# EAGLE design mmcserial (EAGLE 4.01)
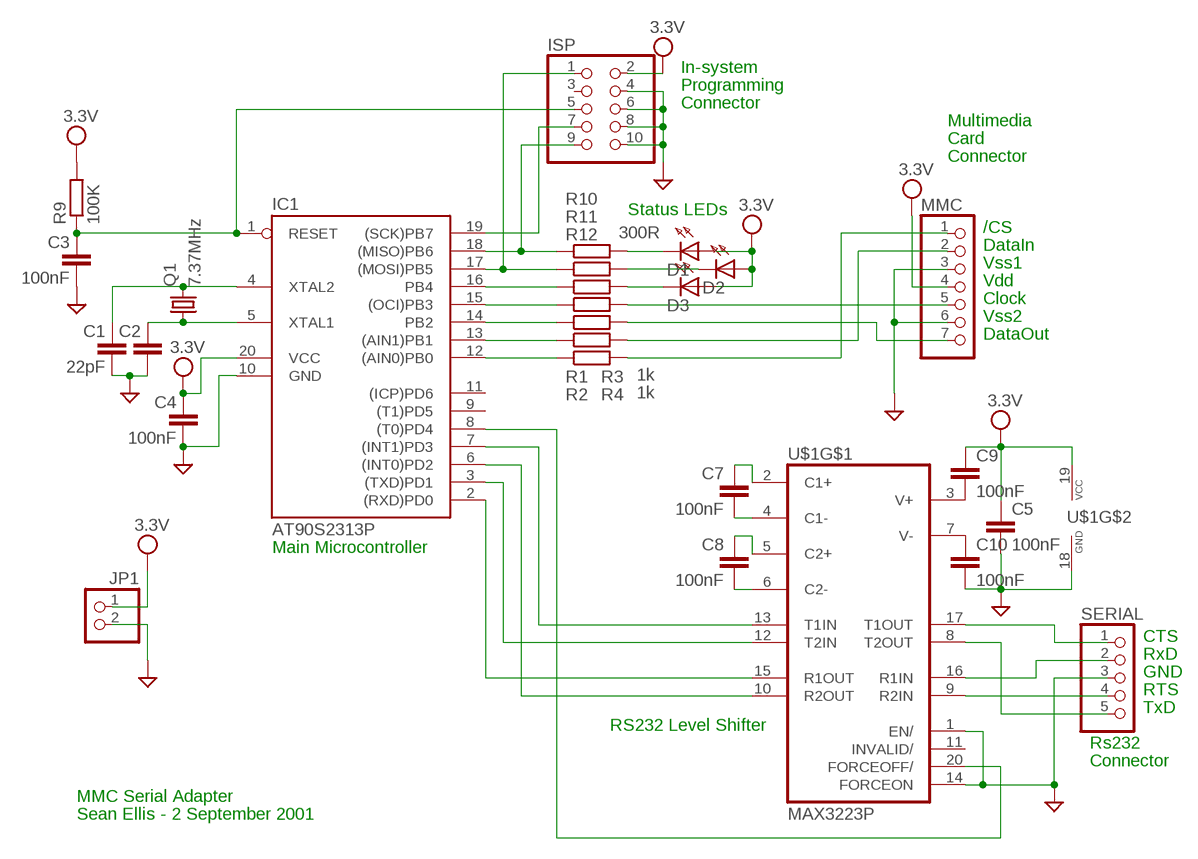
[diagram p0: schematic, sheet 1]

## Parts
C1  22pF  C-EU025-024X044  [C025-024X044]
C2  C-EU025-024X044  [C025-024X044]
C3  100nF  C-EU050-024X044  [C050-024X044]
C4  100nF  C-EU050-024X044  [C050-024X044]
C5  100nF  C-EU050-024X044  [C050-024X044]
C7  100nF  C-EU050-024X044  [C050-024X044]
C8  100nF  C-EU050-024X044  [C050-024X044]
C9  100nF  C-EU050-024X044  [C050-024X044]
C10  100nF  C-EU050-024X044  [C050-024X044]
D1  LED2X5  [LED2X5]
D2  LED2X5  [LED2X5]
D3  LED2X5  [LED2X5]
IC1  AT90S2313P  [DIL20]
ISP  PINHD-2X5  [2X05]
JP1  PINHD-1X2  [1X02]
MMC  PINHD-1X7  [1X07]
Q1  7.37MHz  HC49/S  [HC49/S]
R1  1k  R-EU_0204/5  [0204/5]
R2  R-EU_0204/V2  [0204V]
R3  R-EU_0204/5  [0204/5]
R4  1k  R-EU_0204/5  [0204/5]
R9  100K  R-EU_0204/7  [0204/7]
R10  R-EU_0204/V2  [0204V]
R11  R-EU_0204/5  [0204/5]
R12  300R  R-EU_0204/7  [0204/7]
SERIAL  PINHD-1X5  [1X05]
U$1  MAX3223P  [DIL20]

## Nets
GND: C1.1 C2.1 C3.1 C4.1 C5.1 C10.1 IC1.10(GND) ISP.4 ISP.6 ISP.8 ISP.10 JP1.2 MMC.3 MMC.6 SERIAL.3 U$1.1(EN/) U$1.14(FORCEON) U$1.18(GND)
N$1: SERIAL.1 U$1.17(T1OUT)
N$2: SERIAL.5 U$1.8(T2OUT)
N$3: C3.2 IC1.1(RESET) ISP.5 R9.1
N$5: SERIAL.2 U$1.16(R1IN)
N$6: IC1.8((T0)PD4) U$1.20(FORCEOFF/)
N$7: C9.1 U$1.3(V+)
N$8: IC1.2((RXD)PD0) U$1.15(R1OUT)
N$9: IC1.3((TXD)PD1) U$1.12(T2IN)
N$10: IC1.17((MOSI)PB5) ISP.1 R11.1
N$11: IC1.15((OCI)PB3) R2.1
N$12: IC1.14(PB2) R1.1
N$14: IC1.16(PB4) R12.1
N$15: C10.2 U$1.7(V-)
N$16: MMC.5 R2.2
N$17: SERIAL.4 U$1.9(R2IN)
N$18: IC1.6((INT0)PD2) U$1.10(R2OUT)
N$19: IC1.7((INT1)PD3) U$1.13(T1IN)
N$20: C2.2 IC1.5(XTAL1) Q1.1
N$21: C1.2 IC1.4(XTAL2) Q1.2
N$22: IC1.12((AIN0)PB0) R4.1
N$23: IC1.13((AIN1)PB1) R3.1
N$24: IC1.18((MISO)PB6) ISP.9 R10.1
N$25: IC1.19((SCK)PB7) ISP.7
N$26: C7.2 U$1.2(C1+)
N$27: C7.1 U$1.4(C1-)
N$28: C8.2 U$1.5(C2+)
N$29: C8.1 U$1.6(C2-)
N$30: MMC.7 R1.2
N$31: MMC.2 R3.2
N$32: MMC.1 R4.2
N$33: D1.K(C) R10.2
N$34: D3.K(C) R12.2
N$35: D2.K(C) R11.2
VDD: C4.2 C5.2 C9.2 D1.A D2.A D3.A IC1.20(VCC) ISP.2 JP1.1 MMC.4 R9.2 U$1.19(VCC) ; supply symbol labelled 3.3V
Unconnected: IC1.9((T1)PD5) IC1.11((ICP)PD6) ISP.3 U$1.11(INVALID/)

## Notes on the sheet
- In-system
- Programming
- Connector
- Multimedia
- Card
- Connector
- Status LEDs
- /CS
- DataIn
- Vss1
- Vdd
- Clock
- Vss2
- DataOut
- Main Microcontroller
- CTS
- RxD
- GND
- RTS
- TxD
- RS232 Level Shifter
- Rs232
- Connector
- MMC Serial Adapter
- Sean Ellis - 2 September 2001

## Library data of the parts
C1-C5 C7-C10 = rcl:C-EU: CAPACITOR, European symbol
D1-D3 = led:LED2X5: LED 2 x 5 mm, rectangle
IC1 = atmel:AT90S2313: MICROCONTROLLER 2 Kbytes FLASH 128 bytes SRAM 128 bytes EEPROM UART
ISP = pinhead:PINHD-2X5: PIN HEADER
JP1 = pinhead:PINHD-1X2: PIN HEADER
MMC = pinhead:PINHD-1X7: PIN HEADER
Q1 = crystal:HC49/S: CRYSTAL
R1-R4 R9-R12 = rcl:R-EU_: RESISTOR, European symbol
SERIAL = pinhead:PINHD-1X5: PIN HEADER
U$1 = maxim:MAX3223: MAX3223 RS232 Level Converter 3.3V

## Board
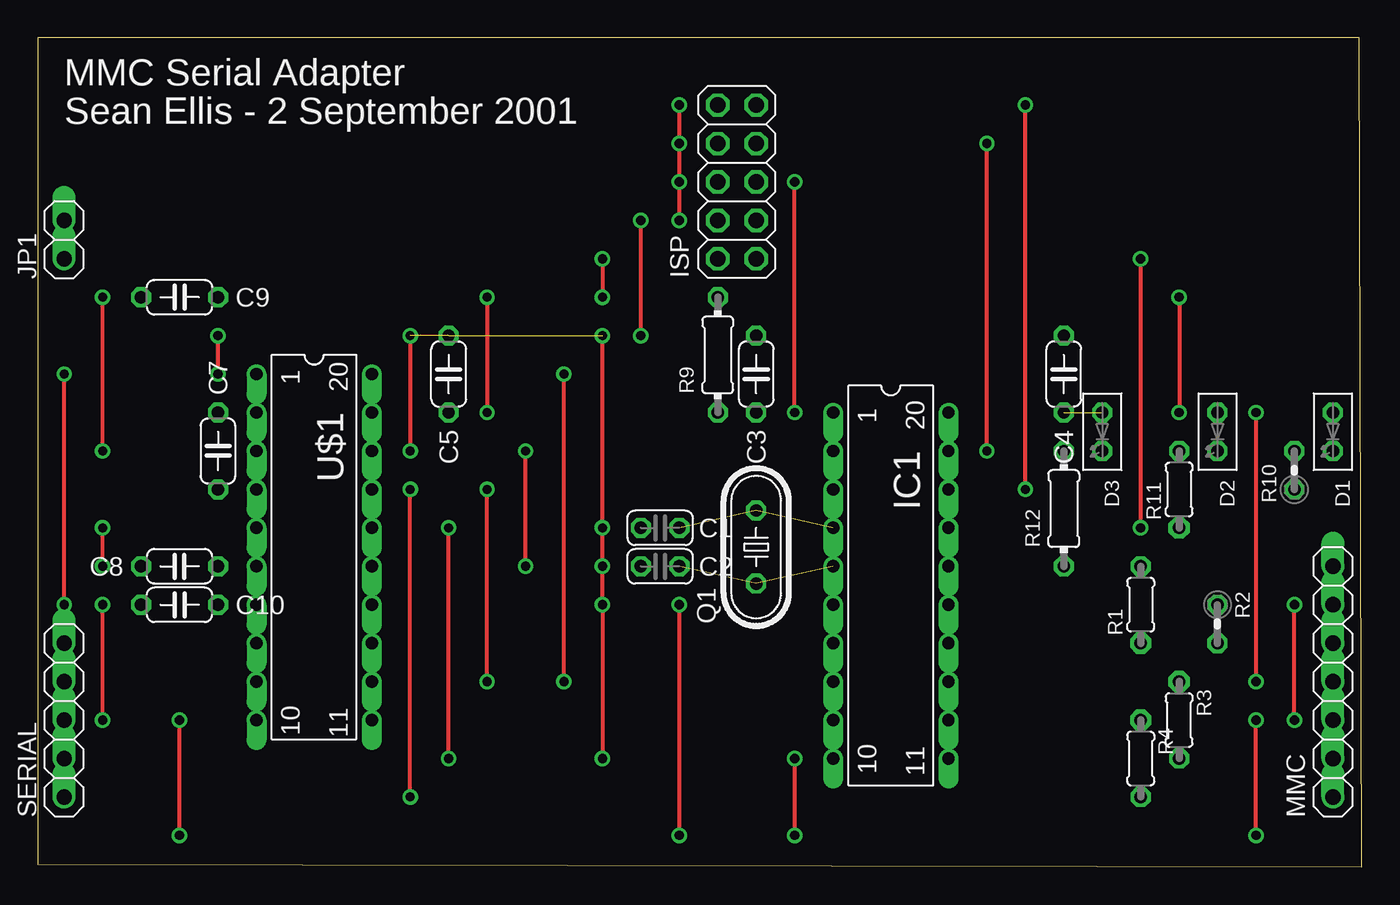
[diagram p1: board, top side]
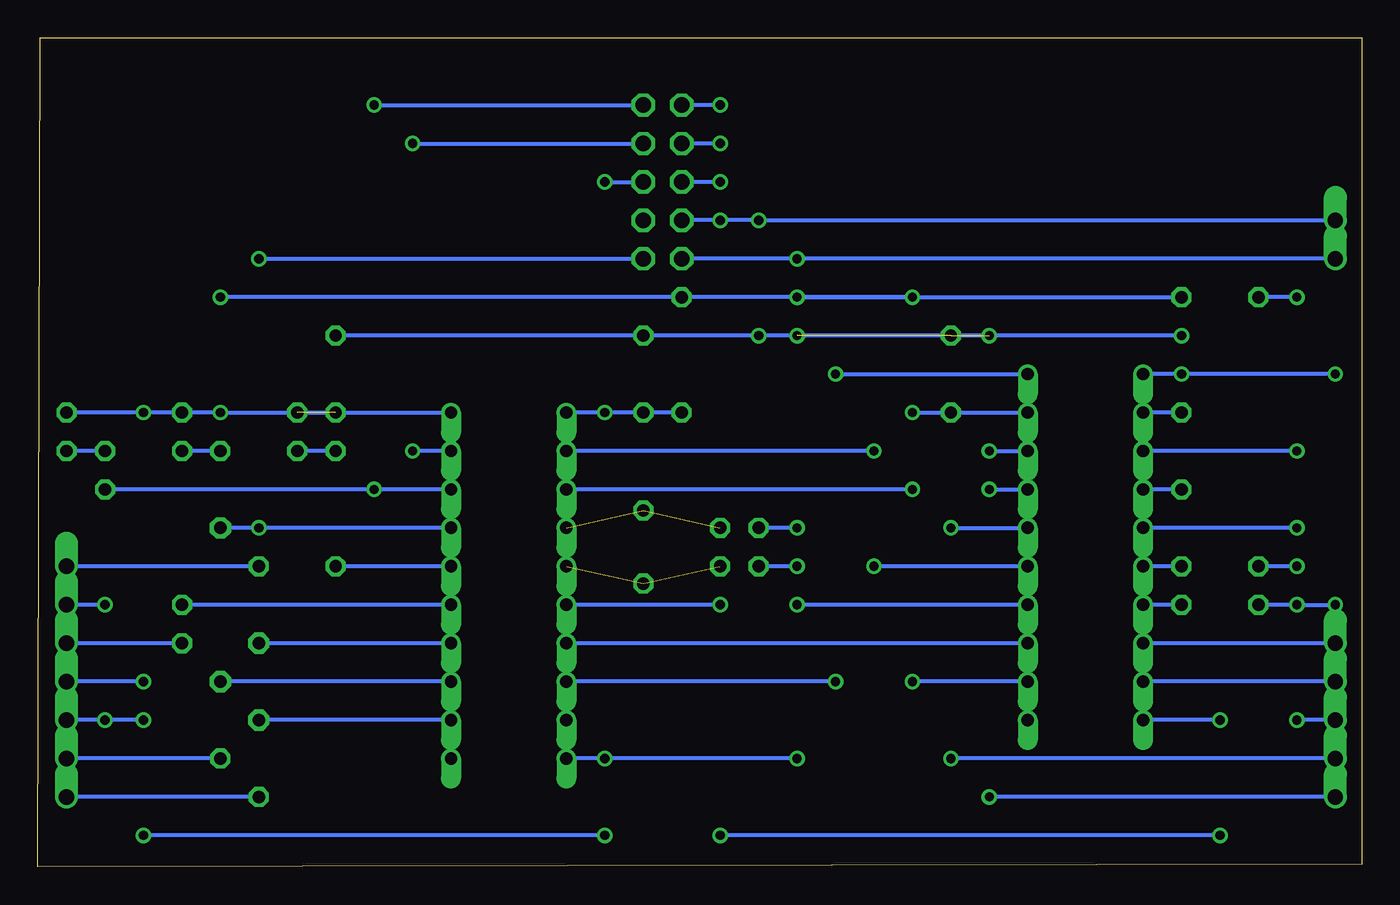
[diagram p2: board, bottom side, seen from below]

Size 87.46 x 54.77 mm. Coordinates in mm from the lower left corner, seen from the top.
Outline: 0,0.17 87.46,0 87.3,54.77 0,54.77 0,0.17
Copper layers used: Top, Bottom
tRestrict: area 25.9,30 to 28.4,35.1; area 43.7,44 to 48.7,51.6; area 46.2,30 to 48.7,35.1; area 10.6,24.9 to 13.2,30; area 6.8,36.4 to 11.9,38.9; area 6.8,18.6 to 11.9,21.1; area 6.8,16 to 11.9,18.6; area 0.5,3.3 to 3,16; area 44.9,14.8 to 50,27.5; area 38.6,21.1 to 43.7,23.7; area 38.6,18.6 to 43.7,21.1; area 66.5,30 to 69.1,35.1; 16 more areas
bRestrict: area 56.3,5.9 to 58.9,31.3; area 39.8,18.6 to 42.4,23.7; area 64,26.2 to 66.5,28.7; area 71.6,26.2 to 74.1,28.7; area 79.2,26.2 to 81.8,28.7; area 46.2,0.8 to 48.7,3.3; area 74.1,13.5 to 76.7,16; area 76.7,8.4 to 79.2,11; area 69,18.6 to 71.6,21.1; area 18.2,8.4 to 20.8,33.8; area 25.9,23.7 to 28.4,26.2; area 28.4,26.2 to 30.9,28.7; 19 more areas

### Footprints (pad centres in the part's own frame; a part is rotated, then mirrored left to right if it is on the bottom)
C025-024X044 = drill 0.813 octagon: 1 -1.27,0; 2 1.27,0
C050-024X044 = drill 0.813 octagon: 1 -2.54,0; 2 2.54,0
LED2X5 = drill 0.813 octagon: A -1.27,0; K 1.27,0
DIL20 = drill 0.813 offset: 1 -11.43,-3.81; 2 -8.89,-3.81; 3 -6.35,-3.81; 4 -3.81,-3.81; 5 -1.27,-3.81; 6 1.27,-3.81; 7 3.81,-3.81; 8 6.35,-3.81; 9 8.89,-3.81; 10 11.43,-3.81; 11 11.43,3.81; 12 8.89,3.81; 13 6.35,3.81; 14 3.81,3.81; 15 1.27,3.81; 16 -1.27,3.81; 17 -3.81,3.81; 18 -6.35,3.81; 19 -8.89,3.81; 20 -11.43,3.81
2X05 = drill 1.016 octagon: 1 -5.08,-1.27; 2 -5.08,1.27; 3 -2.54,-1.27; 4 -2.54,1.27; 5 0,-1.27; 6 0,1.27; 7 2.54,-1.27; 8 2.54,1.27; 9 5.08,-1.27; 10 5.08,1.27
1X02 = drill 1.016 offset: 1 -1.27,0; 2 1.27,0
1X07 = drill 1.016 offset: 1 -7.62,0; 2 -5.08,0; 3 -2.54,0; 4 0,0; 5 2.54,0; 6 5.08,0; 7 7.62,0
HC49/S = drill 0.813 octagon: 1 -2.413,0; 2 2.413,0
0204/5 = drill 0.813 pad 1.397 octagon: 1 -2.54,0 | drill 0.813 octagon: 2 2.54,0
0204V = drill 0.813 octagon: 1 -1.27,0; 2 1.27,0
0204/7 = drill 0.813 octagon: 1 -3.81,0; 2 3.81,0
1X05 = drill 1.016 offset: 1 -5.08,0; 2 -2.54,0; 3 0,0; 4 2.54,0; 5 5.08,0

### Placement (x,y rotation side)
C1  41.11,22.39 0 top
C2  41.11,19.85 0 top
C3  47.46,32.55 270 top
C4  67.78,32.55 270 top
C5  27.14,32.55 270 top
C7  11.9,27.47 90 top
C8  9.36,19.85 180 top
C9  9.36,37.63 0 top
C10  9.36,17.31 0 top
D1  85.56,28.74 270 top
D2  77.94,28.74 270 top
D3  70.32,28.74 270 top
IC1  56.35,18.58 270 top
ISP  46.19,45.25 90 top
JP1  1.74,41.44 90 top
MMC  85.56,12.23 90 top
Q1  47.46,21.12 90 top
R1  72.86,17.31 90 top
R2  77.94,16.04 270 top
R3  75.4,9.69 270 top
R4  72.86,7.15 270 top
R9  44.92,33.82 90 top
R10  83.02,26.2 90 top
R11  75.4,24.93 90 top
R12  67.78,23.66 90 top
SERIAL  1.74,9.69 90 top
U$1  18.25,21.12 270 top

### Tracks (layer width: path | path; a pad name or v marks a point on that pad's centre or on a via)
GND  (via drill 0.61)  (2 unrouted)
  Top 0.254: v42.38,42.71 v42.38,45.25 v42.38,47.79 v42.38,50.33 | v37.3,35.09 v37.3,22.39 v37.3,19.85 v37.3,17.31 v37.3,7.15 | v24.6,35.09 v24.6,27.47 | v39.84,35.09 v39.84,42.71 | v11.9,32.55 v11.9,35.09 | v1.74,17.31 v1.74,32.55 | v4.28,9.69 v4.28,17.31 | v83.02,9.69 v83.02,17.31 | v50,7.15 v50,2.07 | v80.48,2.07 v80.48,9.69
  Bottom 0.254: JP1.2 v39.84,42.71 v42.38,42.71 ISP.4 | v42.38,45.25 ISP.6 | v42.38,47.79 ISP.8 | v42.38,50.33 ISP.10 | U$1.14 v37.3,17.31 | v37.3,22.39 C1.1 | v37.3,19.85 C2.1 | v24.6,27.47 U$1.18 | v1.74,17.31 v4.28,17.31 C10.1 | SERIAL.3 v4.28,9.69 | U$1.1 v11.9,32.55 v1.74,32.55 | v11.9,35.09 v24.6,35.09 v39.84,35.09 C3.1 C4.1 | v37.3,7.15 v50,7.15 IC1.10 | v83.02,17.31 MMC.6 | MMC.3 v83.02,9.69 v80.48,9.69 | v50,2.07 v80.48,2.07
N$1  (via drill 0.61)
  Top 0.254: v24.6,4.61 v24.6,24.93
  Bottom 0.254: v24.6,24.93 U$1.17 | SERIAL.1 v24.6,4.61
N$2
  Bottom 0.254: SERIAL.5 U$1.8
N$3  (via drill 0.61)
  Top 0.254: v50,30.01 v50,45.25
  Bottom 0.254: R9.1 C3.2 v50,30.01 IC1.1 | v50,45.25 ISP.5
N$5  (via drill 0.61)
  Top 0.254: v27.14,7.15 v27.14,22.39
  Bottom 0.254: SERIAL.2 v27.14,7.15 | v27.14,22.39 U$1.16
N$6  (via drill 0.61)
  Top 0.254: v34.76,12.23 v34.76,32.55
  Bottom 0.254: v34.76,32.55 U$1.20 | v34.76,12.23 IC1.8
N$7  (via drill 0.61)
  Top 0.254: v4.28,27.47 v4.28,37.63
  Bottom 0.254: v4.28,37.63 C9.1 | v4.28,27.47 U$1.3
  other vias: 6.82,37.63 6.82,37.63
N$8  (via drill 0.61)
  Top 0.254: v32.22,19.85 v32.22,27.47
  Bottom 0.254: U$1.15 v32.22,19.85 | v32.22,27.47 IC1.2
N$9  (via drill 0.61)
  Top 0.254: v29.68,12.23 v29.68,24.93
  Bottom 0.254: U$1.12 v29.68,12.23 | v29.68,24.93 IC1.3
N$10  (via drill 0.61)
  Top 0.254: v72.86,22.39 v72.86,40.17
  Bottom 0.254: IC1.17 v72.86,22.39 R11.1 | v72.86,40.17 ISP.1
N$11
  Bottom 0.254: IC1.15 R2.1
N$12
  Bottom 0.254: IC1.14 R1.1
N$14
  Bottom 0.254: IC1.16 R12.1
N$15
  Bottom 0.254: C10.2 U$1.7
N$16
  Bottom 0.254: R2.2 MMC.5
N$17
  Bottom 0.254: SERIAL.4 U$1.9
N$18  (via drill 0.61)
  Top 0.254: v9.36,2.07 v9.36,9.69 | v42.38,2.07 v42.38,17.31
  Bottom 0.254: v9.36,9.69 U$1.10 | v9.36,2.07 v42.38,2.07 | v42.38,17.31 IC1.6
N$19
  Bottom 0.254: U$1.13 IC1.7
N$20  (2 unrouted)
N$21  (2 unrouted)
N$22
  Bottom 0.254: IC1.12 R4.1
N$23
  Bottom 0.254: IC1.13 R3.1
N$24  (via drill 0.61)
  Top 0.254: v65.24,24.93 v65.24,50.33
  Bottom 0.254: IC1.18 v65.24,24.93 R10.1 | v65.24,50.33 ISP.9
N$25  (via drill 0.61)
  Top 0.254: v62.7,27.47 v62.7,47.79
  Bottom 0.254: IC1.19 v62.7,27.47 | v62.7,47.79 ISP.7
N$26
  Bottom 0.254: C7.2 U$1.2
N$27
  Bottom 0.254: C7.1 U$1.4
N$28  (via drill 0.61)
  Top 0.254: v4.28,19.85 v4.28,22.39
  Bottom 0.254: v4.28,19.85 C8.2 | v4.28,22.39 U$1.5
N$29
  Bottom 0.254: C8.1 U$1.6
N$30
  Bottom 0.254: R1.2 MMC.7
N$31
  Bottom 0.254: R3.2 MMC.2
N$32
  Bottom 0.254: R4.2 MMC.1
N$33
  Bottom 0.254: R10.2 D1.K
N$34
  Bottom 0.254: R12.2 D3.K
N$35
  Bottom 0.254: R11.2 D2.K
VDD  (via drill 0.61)  (1 unrouted)
  Top 0.254: v29.68,37.63 v29.68,30.01 | v37.3,40.17 v37.3,37.63 | v75.4,37.63 v75.4,30.01 | v80.48,30.01 v80.48,12.23
  Bottom 0.254: ISP.2 v37.3,40.17 JP1.1 | v37.3,37.63 v29.68,37.63 | v29.68,37.63 R9.2 v75.4,37.63 | v37.3,37.63 v29.68,37.63 | v75.4,30.01 D3.A IC1.20 | U$1.19 C5.2 v29.68,30.01 | v37.3,37.63 C9.2 | v75.4,30.01 D2.A | v75.4,30.01 v80.48,30.01 D1.A | v80.48,12.23 MMC.4

### Text on the board
tNames: MMC Serial Adapter | Sean Ellis - 2 September 2001
Document: - | + | 1 | 1 | 1